# EAGLE design 2364_ROM-el_v1.1 (EAGLE 7.7.0)
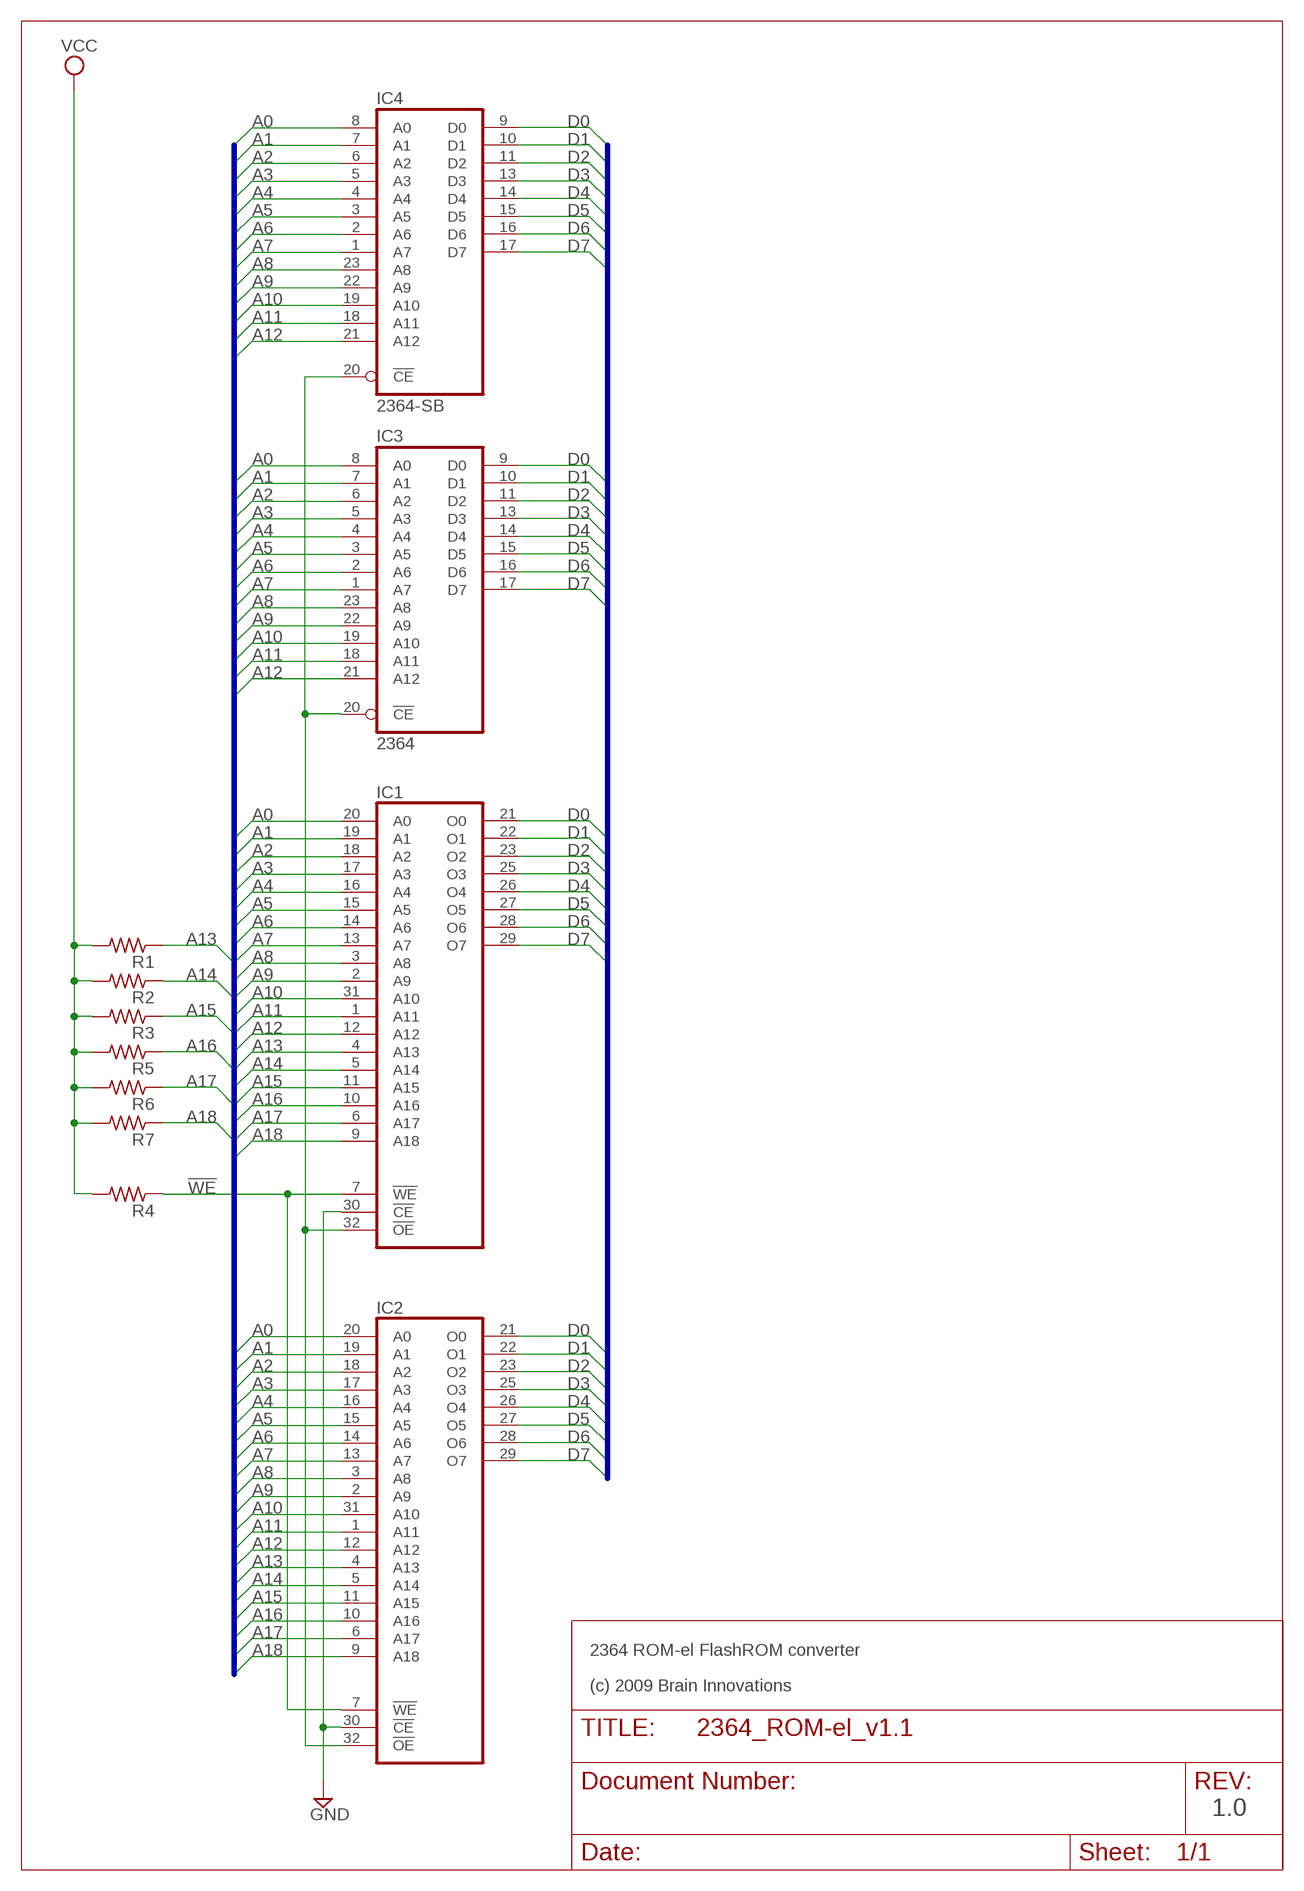
[diagram p0: schematic, sheet 1]

## Parts
IC1  FLASH_RAM4096KB'T'  [TSOP32]
IC2  FLASH_RAM4096KB'V'  [VSOP32]
IC3  2364  2364-RP  [DIL24-ROUNDPAD]
IC4  2364-SB  [DIL24-SMD-REVERSE]
R1  R-US_R0805  [R0805]
R2  R-US_R0805  [R0805]
R3  R-US_R0805  [R0805]
R4  R-US_R0805  [R0805]
R5  R-US_R0805  [R0805]
R6  R-US_R0805  [R0805]
R7  R-US_R0805  [R0805]

## Nets
!WE: IC1.7(!WE) IC2.7(!WE) R4.1
A0: IC1.20(A0) IC2.20(A0) IC3.8(A0) IC4.8(A0)
A1: IC1.19(A1) IC2.19(A1) IC3.7(A1) IC4.7(A1)
A2: IC1.18(A2) IC2.18(A2) IC3.6(A2) IC4.6(A2)
A3: IC1.17(A3) IC2.17(A3) IC3.5(A3) IC4.5(A3)
A4: IC1.16(A4) IC2.16(A4) IC3.4(A4) IC4.4(A4)
A5: IC1.15(A5) IC2.15(A5) IC3.3(A5) IC4.3(A5)
A6: IC1.14(A6) IC2.14(A6) IC3.2(A6) IC4.2(A6)
A7: IC1.13(A7) IC2.13(A7) IC3.1(A7) IC4.1(A7)
A8: IC1.3(A8) IC2.3(A8) IC3.23(A8) IC4.23(A8)
A9: IC1.2(A9) IC2.2(A9) IC3.22(A9) IC4.22(A9)
A10: IC1.31(A10) IC2.31(A10) IC3.19(A10) IC4.19(A10)
A11: IC1.1(A11) IC2.1(A11) IC3.18(A11) IC4.18(A11)
A12: IC1.12(A12) IC2.12(A12) IC3.21(A12) IC4.21(A12)
A13: IC1.4(A13) IC2.4(A13) R1.1
A14: IC1.5(A14) IC2.5(A14) R2.1
A15: IC1.11(A15) IC2.11(A15) R3.1
A16: IC1.10(A16) IC2.10(A16) R5.1
A17: IC1.6(A17) IC2.6(A17) R6.1
A18: IC1.9(A18) IC2.9(A18) R7.1
D0: IC1.21(O0) IC2.21(O0) IC3.9(D0) IC4.9(D0)
D1: IC1.22(O1) IC2.22(O1) IC3.10(D1) IC4.10(D1)
D2: IC1.23(O2) IC2.23(O2) IC3.11(D2) IC4.11(D2)
D3: IC1.25(O3) IC2.25(O3) IC3.13(D3) IC4.13(D3)
D4: IC1.26(O4) IC2.26(O4) IC3.14(D4) IC4.14(D4)
D5: IC1.27(O5) IC2.27(O5) IC3.15(D5) IC4.15(D5)
D6: IC1.28(O6) IC2.28(O6) IC3.16(D6) IC4.16(D6)
D7: IC1.29(O7) IC2.29(O7) IC3.17(D7) IC4.17(D7)
GND: IC1.30(!CE) IC2.30(!CE)
N$1: IC1.32(!OE) IC2.32(!OE) IC3.20(!CE) IC4.20(!CE)
VCC: R1.2 R2.2 R3.2 R4.2 R5.2 R6.2 R7.2

## Buses
A[0..18]
D[0..7]

## Notes on the sheet
- 2364 ROM-el FlashROM converter
- (c) 2009 Brain Innovations
- 1.0

## Power pins joined to a net without a drawn wire
GND: IC1.24(GND) IC2.24(GND) IC3.12(GND) IC4.12(GND)
VCC: IC1.8(VCC) IC2.8(VCC) IC3.24(VCC) IC4.24(VCC)

## Library data of the parts
IC1 IC2 = memory-jedec:FLASH_RAM4096KB
IC3 IC4 = commodore:2364
R1-R7 = resistor:R-US_: RESISTOR, American symbol

## Board
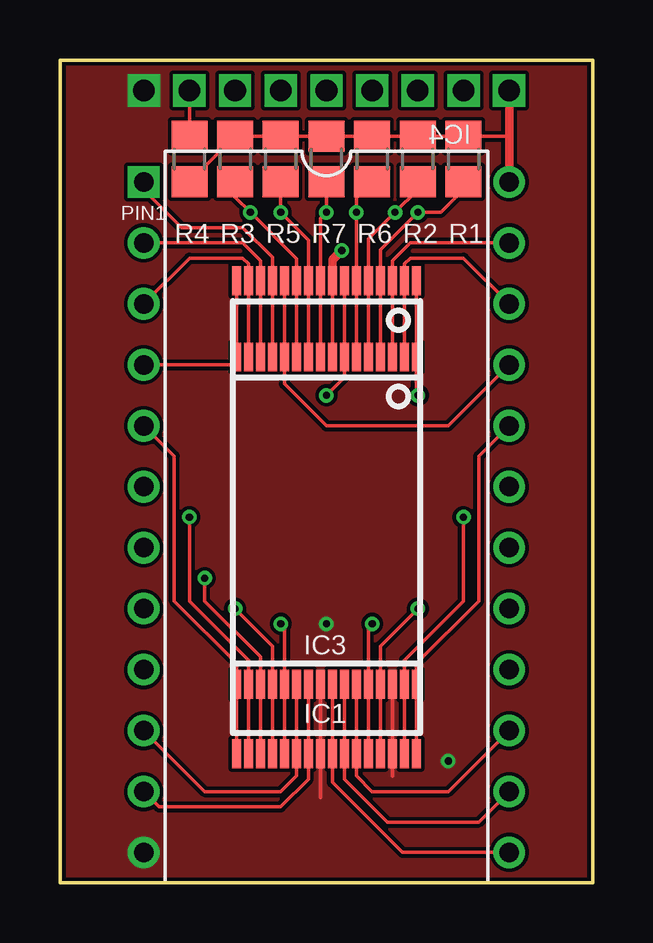
[diagram p1: board, top side]
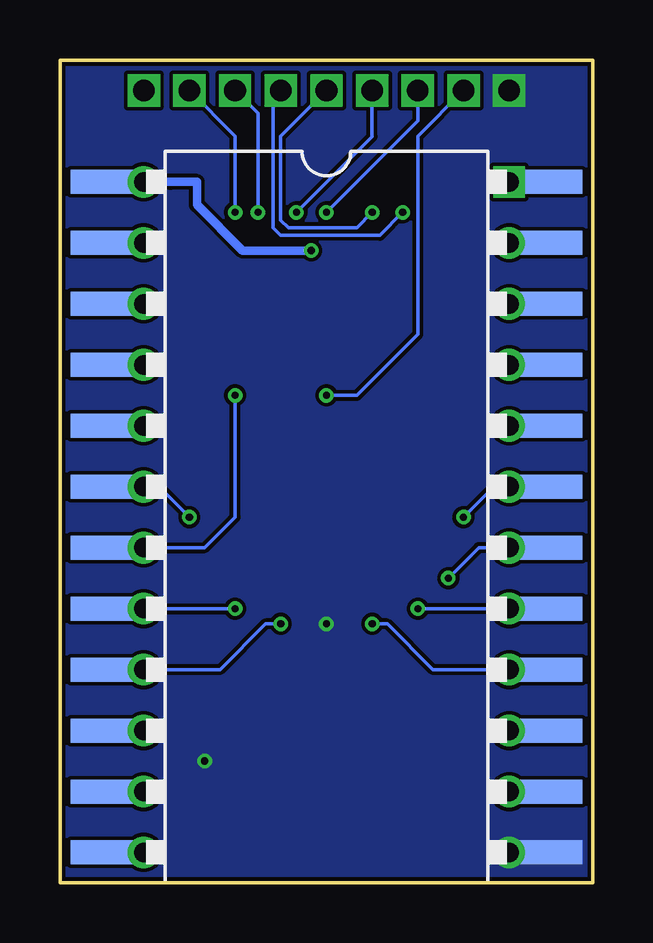
[diagram p2: board, bottom side, seen from below]

Size 22.23 x 34.29 mm. Coordinates in mm from the lower left corner, seen from the top.
Outline: 0,0 22.23,0 22.23,34.29 0,34.29 0,0
Copper layers (1*16): Top 0.035mm / dielectric 1.5mm / Bottom 0.035mm
Design rules "hackvana *": minimum track width 6mil, minimum drill 0.3mm, track to track 6mil, track to pad 6mil, pad to pad 6mil, via to via 6mil, smd to smd 0mil, copper to edge 6mil, drill to drill 6mil, minimum pad ring 10mil, minimum via ring 6mil, stop-mask expansion 2mil, vias tented up to drill 100mil, thermal gap 10mil

### Footprints (pad centres in the part's own frame; a part is rotated, then mirrored left to right if it is on the bottom)
TSOP32 = smd 1.2 x 0.36: 1 -9.85,3.75; 2 -9.85,3.25; 3 -9.85,2.75; 4 -9.85,2.25; 5 -9.85,1.75; 6 -9.85,1.25; 7 -9.85,0.75; 8 -9.85,0.25; 9 -9.85,-0.25; 10 -9.85,-0.75; 11 -9.85,-1.25; 12 -9.85,-1.75; 13 -9.85,-2.25; 14 -9.85,-2.75; 15 -9.85,-3.25; 16 -9.85,-3.75; 17 9.85,-3.75; 18 9.85,-3.25; 19 9.85,-2.75; 20 9.85,-2.25; 21 9.85,-1.75; 22 9.85,-1.25; 23 9.85,-0.75; 24 9.85,-0.25; 25 9.85,0.25; 26 9.85,0.75; 27 9.85,1.25; 28 9.85,1.75; 29 9.85,2.25; 30 9.85,2.75; 31 9.85,3.25; 32 9.85,3.75
VSOP32 = smd 1.2 x 0.36: 1 -7.31,3.75; 2 -7.31,3.25; 3 -7.31,2.75; 4 -7.31,2.25; 5 -7.31,1.75; 6 -7.31,1.25; 7 -7.31,0.75; 8 -7.31,0.25; 9 -7.31,-0.25; 10 -7.31,-0.75; 11 -7.31,-1.25; 12 -7.31,-1.75; 13 -7.31,-2.25; 14 -7.31,-2.75; 15 -7.31,-3.25; 16 -7.31,-3.75; 17 6.322,-3.75; 18 6.322,-3.25; 19 6.322,-2.75; 20 6.322,-2.25; 21 6.322,-1.75; 22 6.322,-1.25; 23 6.322,-0.75; 24 6.322,-0.25; 25 6.322,0.25; 26 6.322,0.75; 27 6.322,1.25; 28 6.322,1.75; 29 6.322,2.25; 30 6.322,2.75; 31 6.322,3.25; 32 6.322,3.75
DIL24-ROUNDPAD = drill 0.813 square: 1 -13.97,-7.62 | drill 0.813: 2 -11.43,-7.62; 3 -8.89,-7.62; 4 -6.35,-7.62; 5 -3.81,-7.62; 6 -1.27,-7.62; 7 1.27,-7.62; 8 3.81,-7.62; 9 6.35,-7.62; 10 8.89,-7.62; 11 11.43,-7.62; 12 13.97,-7.62; 13 13.97,7.62; 14 11.43,7.62; 15 8.89,7.62; 16 6.35,7.62; 17 3.81,7.62; 18 1.27,7.62; 19 -1.27,7.62; 20 -3.81,7.62; 21 -6.35,7.62; 22 -8.89,7.62; 23 -11.43,7.62; 24 -13.97,7.62
DIL24-SMD-REVERSE = smd 1 x 3.5 bottom: 1 -13.97,-8.92; 2 -11.43,-8.92; 3 -8.89,-8.92; 4 -6.35,-8.92; 5 -3.81,-8.92; 6 -1.27,-8.92; 7 1.27,-8.92; 8 3.81,-8.92; 9 6.35,-8.92; 10 8.89,-8.92; 11 11.43,-8.92; 12 13.97,-8.92; 13 13.97,8.92; 14 11.43,8.92; 15 8.89,8.92; 16 6.35,8.92; 17 3.81,8.92; 18 1.27,8.92; 19 -1.27,8.92; 20 -3.81,8.92; 21 -6.35,8.92; 22 -8.89,8.92; 23 -11.43,8.92; 24 -13.97,8.92
R0805 = smd 1.3 x 1.5: 1 -0.95,0; 2 0.95,0

### Placement (x,y rotation side)
IC1  11.11,15.24 270 top
IC2  11.11,14.61 270 top
IC3  11.11,15.24 270 top
IC4  11.11,15.24 270 top
R1  16.83,30.16 90 top
R2  14.92,30.16 90 top
R3  7.3,30.16 90 top
R4  5.4,30.16 270 top
R5  9.21,30.16 90 top
R6  13.02,30.16 90 top
R7  11.11,30.16 90 top

### Tracks (layer width: path | path; a pad name or v marks a point on that pad's centre or on a via)
!WE  (via drill 0.3, 0.9)
  Top 0.152: IC2.7 11.86,21.07 v11.11,20.32 | IC2.7 IC1.7 IC2.7 | v5.4,33.02 R4.1
  Bottom 0.152: v11.11,20.32 9.84,20.32 7.3,22.86 7.3,31.11 v5.4,33.02
A0  (via drill 0.3)
  Top 0.152: IC1.20 IC2.20 8.86,9.87 v7.3,11.43
  Bottom 0.152: IC4.8 IC3.8 v7.3,11.43
A1  (via drill 0.3)
  Top 0.152: IC1.19 IC2.19 8.36,9.42 6.03,11.75 v6.03,12.7
  Bottom 0.152: IC4.7 IC3.7 4.76,13.97 v6.03,12.7
A2  (via drill 0.3)
  Top 0.152: v5.4,15.24 5.4,11.75 7.86,9.28 IC2.18 IC1.18
  Bottom 0.152: IC4.6 IC3.6 4.13,16.51 v5.4,15.24
A3
  Top 0.152: IC3.5 4.76,17.78 4.76,11.75 7.36,9.15 IC2.17 IC1.17
  Bottom 0.152: IC4.5 IC3.5
A4
  Top 0.152: IC1.16 IC2.16 7.36,21.59 IC3.4
  Bottom 0.152: IC4.4 IC3.4
A5
  Top 0.152: IC3.3 5.4,26.04 7.62,26.04 7.86,25.79 IC1.15 IC2.15
  Bottom 0.152: IC4.3 IC3.3
A6
  Top 0.152: IC3.2 7.62,26.67 8.36,25.93 IC1.14 IC2.14
  Bottom 0.152: IC4.2 IC3.2
A7
  Top 0.152: IC3.1 3.49,28.89 5.08,27.3 7.62,27.3 8.86,26.06 IC1.13 IC2.13
  Bottom 0.152: IC4.1 IC3.1
A8
  Top 0.152: IC3.23 14.61,26.67 13.86,25.93 IC1.3 IC2.3
  Bottom 0.152: IC4.23 IC3.23
A9
  Top 0.152: IC2.2 IC1.2 14.36,25.79 14.61,26.04 16.83,26.04 IC3.22
  Bottom 0.152: IC4.22 IC3.22
A10  (via drill 0.3)
  Top 0.152: IC1.31 IC2.31 14.36,9.28 16.83,11.75 v16.83,15.24
  Bottom 0.152: IC4.19 IC3.19 18.1,16.51 v16.83,15.24
A11  (via drill 0.3)
  Top 0.152: IC1.1 IC2.1 14.86,20.32 v14.92,20.32
  Bottom 0.152: v14.92,20.32 14.92,15.24 16.19,13.97 IC3.18 IC4.18
A12
  Top 0.152: IC1.12 IC2.12 9.36,20.8 11.11,19.05 16.19,19.05 IC3.21
  Bottom 0.152: IC4.21 IC3.21
A13  (via drill 0.3, 0.9)
  Top 0.152: R1.1 16.83,28.89 15.87,27.94 v14.92,27.94 13.36,26.38 IC1.4 IC2.4
  Bottom 0.152: v14.92,27.94 14.92,31.11 v16.83,33.02
A14  (via drill 0.3, 0.9)
  Top 0.152: R2.1 14.92,28.89 v13.97,27.94 12.86,26.83 IC1.5 IC2.5
  Bottom 0.152: v13.97,27.94 13.97,32.07 v14.92,33.02
A15  (via drill 0.3, 0.9)
  Top 0.152: R3.1 7.3,28.57 v7.94,27.94 9.86,26.02 IC1.11 IC2.11
  Bottom 0.152: 7.94,27.96 v7.94,27.94 8.89,26.99 13.02,26.99 13.34,27.3 13.34,32.7 v13.02,33.02
A16  (via drill 0.3, 0.9)
  Top 0.152: R5.1 v9.21,27.94 10.36,26.79 IC1.10 IC2.10
  Bottom 0.152: v11.11,33.02 13.02,31.11 13.02,27.62 12.7,27.3 9.84,27.3 v9.21,27.94
A17  (via drill 0.3, 0.9)
  Top 0.152: IC2.6 IC1.6 v12.36,27.94 12.36,28.56 R6.1 | IC2.6 12.36,21.61 12.38,21.59 12.38,21.89 IC2.6
  Bottom 0.152: v9.21,33.02 9.21,31.09 v12.36,27.94
A18  (via drill 0.3, 0.9)
  Top 0.152: IC2.9 IC1.9 10.86,27.69 v11.11,27.94 R7.1
  Bottom 0.152: v7.3,33.02 7.3,31.75 v11.11,27.94
D0  (via drill 0.3)
  Top 0.152: IC1.21 IC2.21 9.36,10.64 v9.21,10.79
  Bottom 0.152: v9.21,10.79 8.57,10.79 6.67,8.89 IC3.9 IC4.9
D1
  Top 0.152: IC3.10 6.03,3.81 9.21,3.81 9.86,4.46 IC1.22 IC2.22
  Bottom 0.152: IC4.10 IC3.10
D2
  Top 0.152: IC3.11 4.13,3.17 9.21,3.17 10.36,4.33 IC1.23 IC2.23
  Bottom 0.152: IC4.11 IC3.11
D3
  Top 0.152: IC3.13 14.29,1.27 11.36,4.2 IC1.25 IC2.25
  Bottom 0.152: IC4.13 IC3.13
D4
  Top 0.152: IC3.14 17.46,2.54 13.65,2.54 11.86,4.33 IC1.26 IC2.26
  Bottom 0.152: IC4.14 IC3.14
D5
  Top 0.152: IC3.15 16.19,3.81 13.02,3.81 12.36,4.46 IC1.27 IC2.27
  Bottom 0.152: IC4.15 IC3.15
D6  (via drill 0.3)
  Top 0.152: v13.02,10.79 12.86,10.64 IC2.28 IC1.28
  Bottom 0.152: v13.02,10.79 13.65,10.79 15.56,8.89 IC3.16 IC4.16
D7  (via drill 0.3)
  Top 0.152: IC1.29 IC2.29 13.36,9.87 v14.92,11.43
  Bottom 0.152: IC4.17 IC3.17 v14.92,11.43
GND  (via drill 0.3, 0.9)
  Top 0.152: 10.86,3.56 IC1.24 IC2.24 | 13.86,4.45 IC1.30 IC2.30
  other vias: 16.19,5.08 11.11,10.79 3.49,33.02
  pour Top (no thermals): 0,34.29 22.23,34.29 22.23,0 0,0
  pour Bottom (no thermals): 0,34.29 22.23,34.29 22.23,0 0,0
N$1
  Top 0.152: IC1.32 IC2.32 14.86,9.15 17.46,11.75 17.46,17.78 IC3.20
  Bottom 0.152: IC4.20 IC3.20
VCC  (via drill 0.3, 0.9)
  Top 0.152: IC3.24 18.73,30.48 | IC2.8 IC1.8 | 18.73,31.11 R1.2 R2.2 R6.2 R7.2 R5.2 R3.2 R4.2
  Top 0.356: IC3.24 18.73,31.11 v18.73,33.02 | IC1.8 11.36,25.97 v11.75,26.35
  Bottom 0.152: IC4.24 IC3.24
  Bottom 0.356: IC3.24 17.61,29.21 16.51,29.21 16.51,28.26 14.61,26.35 v11.75,26.35

### Text on the board
tNames: PIN1
tValues: GND | !WE | 18 | 17 | 16 | 15 | 14 | 13 | VCC | ROM-el | www.go4retro.com | (c)2009-17 RETRO Innovations